# Altium schematic sheet PCB_Master_Traffic_Light_BLOCK_DIAGRAM.SchDoc
size A3; SheetNumber: 2; SheetTotal: 3
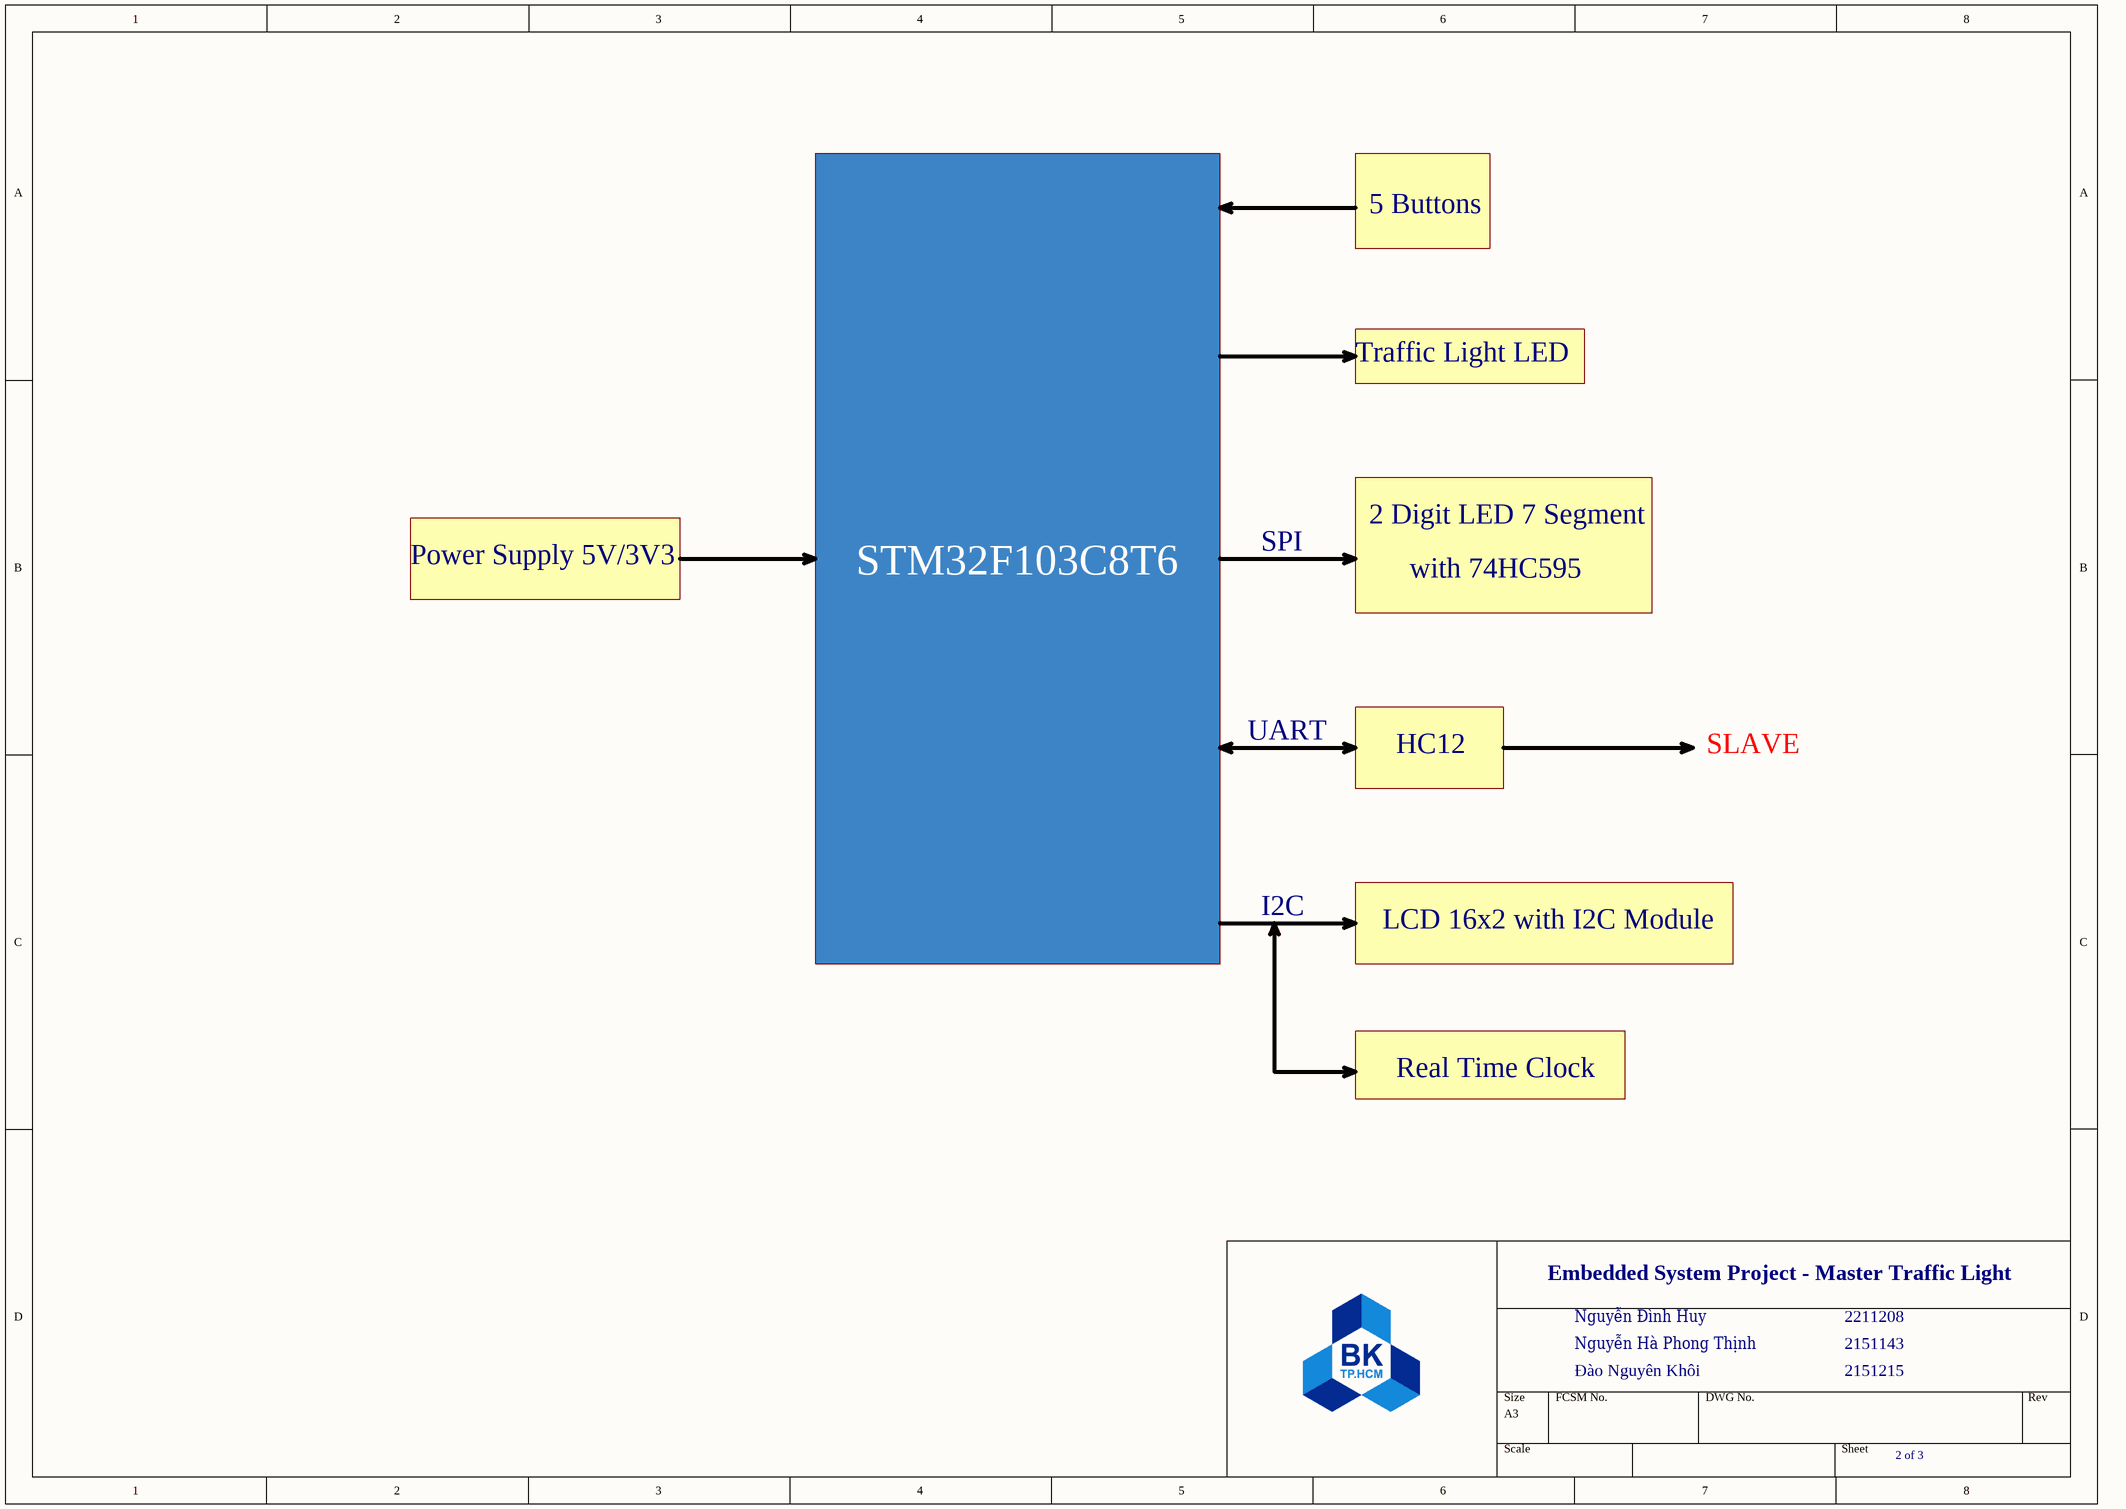
[diagram p0: PCB_Master_Traffic_Light_BLOCK_DIAGRAM.SchDoc]

## Notes on the sheet
- 5 Buttons
- Traffic Light LED
- Power Supply 5V/3V3
- STM32F103C8T6
- SPI
- 2 Digit LED 7 Segment
- with 74HC595
- UART
- HC12
- SLAVE
- I2C
- LCD 16x2 with I2C Module
- Real Time Clock
- Embedded System Project - Master Traffic Light
- Nguyễn Đình Huy
- 2211208
- Nguyễn Hà Phong Thịnh
- Đào Nguyên Khôi
- 2151143
- 2151215
- 2 of 3